# Altium schematic sheet 2_Sensor.schdoc
size 309 x 220 mm; Symbol: Sheet-Symbol_A4; Device: Sheet-Symbol_A4; @Project Name: 2026_ALTIS_V2.0; @Page Count: 3; @Update Date: 2026-04-05; @Create Date: 2026-04-05; @Schematic Name: 2026_ALTIS; @Page No: 2; @Page Name: Sensor; Company: EasyEDA.com; Version: V1.0; Page Size: A4; @Create Time: 05:22:19; @Update Time: 14:22:30; @Board Name: 2026_ALTIS
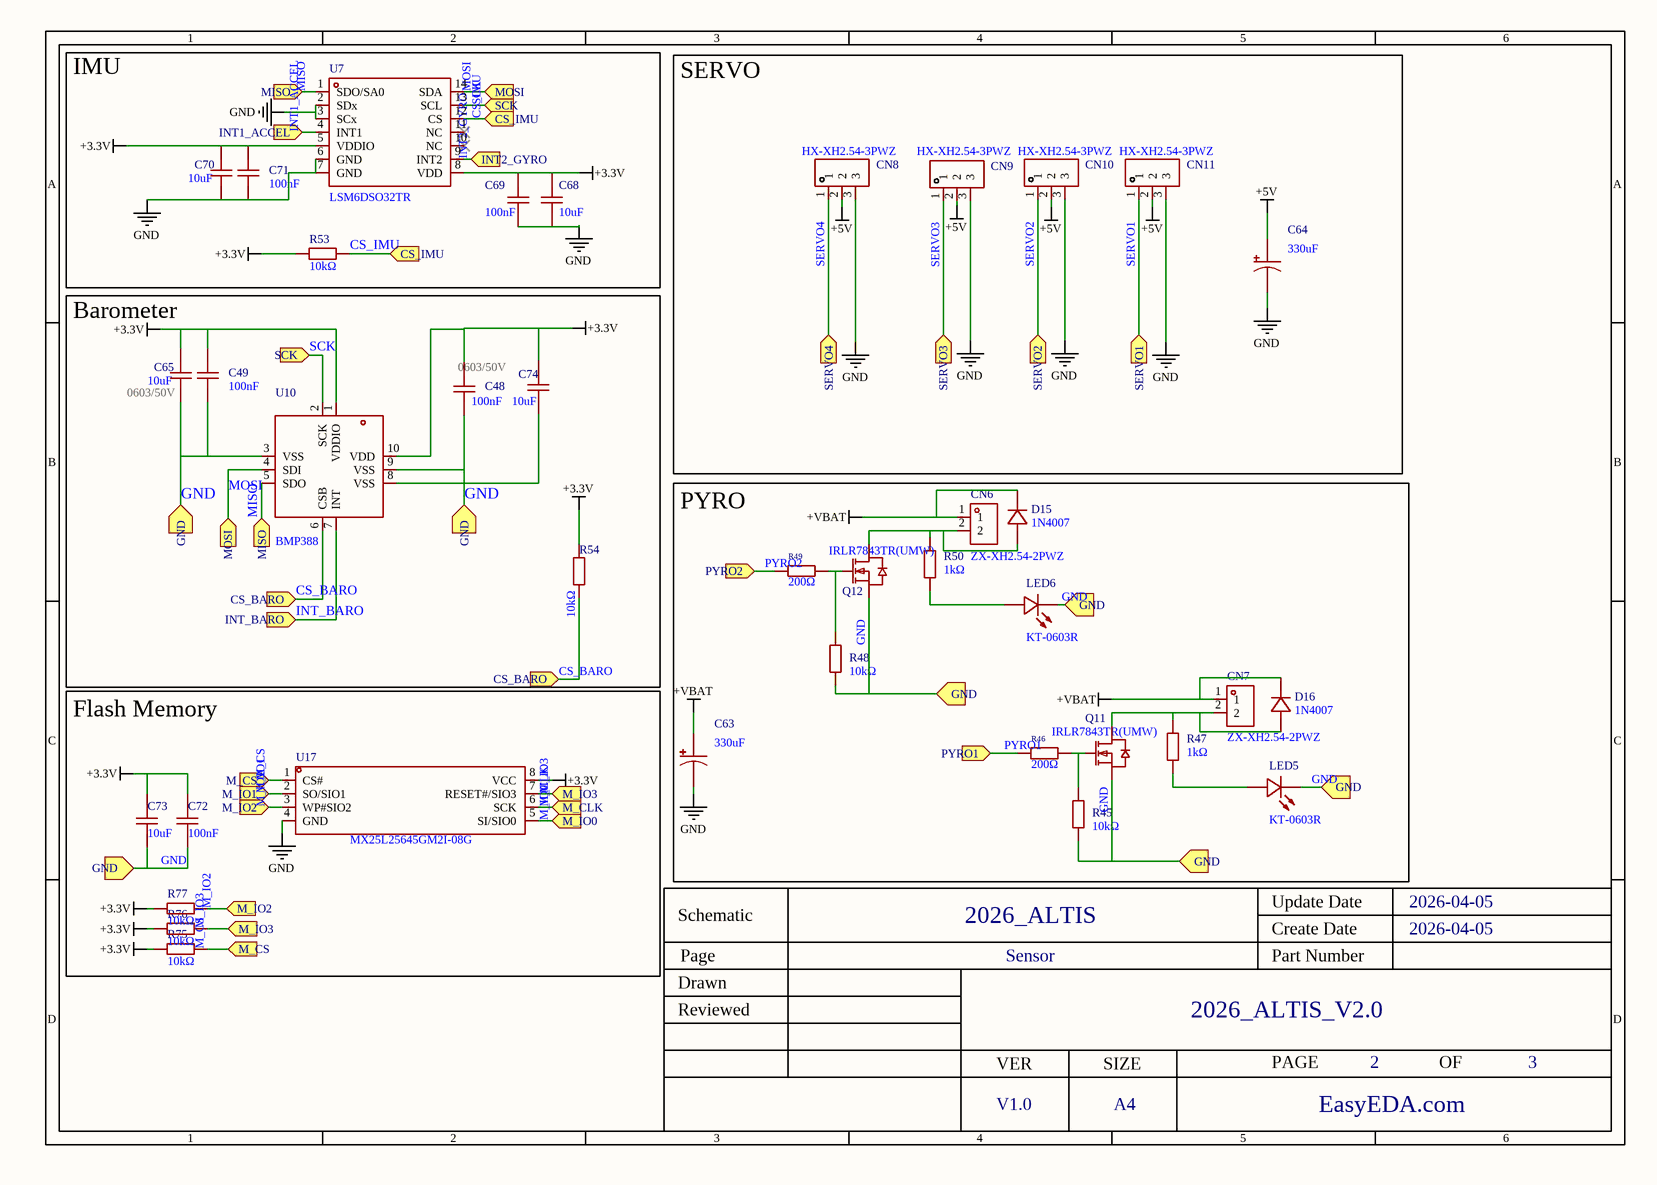
[diagram p0: 2_Sensor.schdoc]

## Parts
C48  100nF  [C0603]
C49  100nF  [C0603]
C63  330uF  [CAP-SMD_BD8.0-L8.3-W8.3-LS9.3-FD-1]
C64  330uF  [CAP-SMD_BD8.0-L8.3-W8.3-LS9.3-FD-1]
C65  10uF  [C0603]
C68  10uF  [C0603]
C69  100nF  [C0603]
C70  10uF  [C0603]
C71  100nF  [C0603]
C72  100nF  [C0603]
C73  10uF  [C0603]
C74  10uF  [C0603]
CN6  ZX-XH2.54-2PWZ  [CONN-TH_2P-P2.50_ZX-XH2.54-2PWZ]
CN7  ZX-XH2.54-2PWZ  [CONN-TH_2P-P2.50_ZX-XH2.54-2PWZ]
CN8  HX-XH2.54-3PWZ  [CONN-TH_3P-P2.50_BX-HA2.54-3PWZ]
CN9  HX-XH2.54-3PWZ  [CONN-TH_3P-P2.50_BX-HA2.54-3PWZ]
CN10  HX-XH2.54-3PWZ  [CONN-TH_3P-P2.50_BX-HA2.54-3PWZ]
CN11  HX-XH2.54-3PWZ  [CONN-TH_3P-P2.50_BX-HA2.54-3PWZ]
D15  1N4007  [SMA_L4.3-W2.5-LS5.0-RD]
D16  1N4007  [SMA_L4.3-W2.5-LS5.0-RD]
LED5  KT-0603R  [LED0603-RD]
LED6  KT-0603R  [LED0603-RD]
Q11  IRLR7843TR(UMW)  [TO-252-2_L6.5-W6.1-P4.58-LS10.0-BL]
Q12  IRLR7843TR(UMW)  [TO-252-2_L6.5-W6.1-P4.58-LS10.0-BL]
R45  10kΩ  [R0603]
R46  200Ω  [R0603]
R47  1kΩ  [R0603]
R48  10kΩ  [R0603]
R49  200Ω  [R0603]
R50  1kΩ  [R0603]
R53  10kΩ  [R0603]
R54  10kΩ  [R0603]
R75  10kΩ  [R0603]
R76  10kΩ  [R0603]
R77  10kΩ  [R0603]
U7  LSM6DSO32TR  [LGA-14_L3.0-W2.5-P0.50-TL]
U10  BMP388  [SENSORM-SMD_BMP388]
U17  MX25L25645GM2I-08G  [SOIC-8_L5.3-W5.3-P1.27-LS8.0-BL]

## Blocks framed on the sheet
IMU: C68-C71 R53 U7
SERVO: C64 CN8-CN11
Barometer: C48 C49 C65 C74 R54 U10
PYRO: C63 CN6 CN7 D15 D16 LED5 LED6 Q11 Q12 R45-R50
Flash Memory: C72 C73 R75-R77 U17

## Ports
CS_BARO (in), CS_IMU (in), GND (in), INT1_ACCEL (in), INT2_GYRO (in), INT_BARO (in), M_CLK (in), M_CS (in), M_IO0 (in), M_IO1 (in), M_IO2 (in), M_IO3 (in), MISO (in), MOSI (in), PYRO1 (in), PYRO2 (in), SCK (in), SERVO1 (in), SERVO2 (in), SERVO3 (in), SERVO4 (in)

## Nets
+3.3V: C48.2 C49.2 C65.2 C68.2 C69.2 C70.2 C71.2 C72.2 C73.2 C74.2 R53.2 R54.2 R75.2 R76.2 R77.2 U7.5(VDDIO) U7.8(VDD) U10.1(VDDIO) U10.10(VDD) U17.8(VCC)
+5V: C64.1 CN8.2 CN9.2 CN10.2 CN11.2
+VBAT: C63.1 CN6.1 CN7.1 D15.1(K) D16.1(K)
GND: C48.1 C49.1 C63.2 C64.2 C65.1 C68.1 C69.1 C70.1 C71.1 C72.1 C73.1 C74.1 CN8.3 CN9.3 CN10.3 CN11.3 LED5.1(K) LED6.1(K) Q11.3(S) Q12.3(S) R45.1 R48.1 U7.2(SDx) U7.3(SCx) U7.6(GND) U7.7(GND) U10.3(VSS) U10.8(VSS) U10.9(VSS) U17.4(GND) ; port GND
CS_BARO: R54.1 U10.6(CSB) ; port CS_BARO
CS_IMU: R53.1 U7.12(CS) ; port CS_IMU
INT1_ACCEL: U7.4(INT1) ; port INT1_ACCEL
INT2_GYRO: U7.9(INT2) ; port INT2_GYRO
INT_BARO: U10.7(INT) ; port INT_BARO
M_CLK: U17.6(SCK) ; port M_CLK
M_CS: R75.1 U17.1(CS#) ; port M_CS
M_IO0: U17.5(SI/SIO0) ; port M_IO0
M_IO1: U17.2(SO/SIO1) ; port M_IO1
M_IO2: R77.1 U17.3(WP#SIO2) ; port M_IO2
M_IO3: R76.1 U17.7(RESET#/SIO3) ; port M_IO3
MISO: U7.1(SDO/SA0) U10.5(SDO) ; port MISO
MOSI: U7.14(SDA) U10.4(SDI) ; port MOSI
PYRO1: R46.1 ; port PYRO1
PYRO2: R49.1 ; port PYRO2
SCK: U7.13(SCL) U10.2(SCK) ; port SCK
SERVO1: CN11.1 ; port SERVO1
SERVO2: CN10.1 ; port SERVO2
SERVO3: CN9.1 ; port SERVO3
SERVO4: CN8.1 ; port SERVO4
NetCN6_2: CN6.2 D15.2(A) Q12.2(D) R50.2
NetCN7_2: CN7.2 D16.2(A) Q11.2(D) R47.2
NetLED5_2: LED5.2(A) R47.1
NetLED6_2: LED6.2(A) R50.1
NetQ11_1: Q11.1(G) R45.2 R46.2
NetQ12_1: Q12.1(G) R48.2 R49.2

Not connected (* = marked no-connect by the designer): U7 10(NC)* 11(NC)*

## Notes on the sheet
- (near C65) 0603/50V
- (near C48) 0603/50V
- 1
- 2
- 3
- 4
- 5
- 6
- A
- B
- C
- Schematic
- 2026_ALTIS
- Create Date
- Update Date
- 2026-04-05
- Reviewed
- Drawn
- Page
- Sensor
- Part Number
- 2026_ALTIS_V2.0
- D
- VER
- SIZE
- PAGE
- OF
- V1.0
- A4
- EasyEDA.com

## Library data of the parts
C48 C49 C69 C71 C72 = CC0603KRX7R9BB104: Manufacturer: YAGEO(国巨); Add into BOM: yes; Tolerance: ±10%; Voltage Rating: 50V; Temperature Coefficient: X7R; Symbol: CC0603KRX7R9BB104; Device: CC0603KRX7R9BB104; LCSC Part Name: 100nF ±10% 50V; Supplier Part: C14663; Manufacturer Part: CC0603KRX7R9BB104; Supplier Footprint: 0603; Datasheet: https://item.szlcsc.com/datasheet/CC0603KRX7R9BB104/15331.html; Supplier: LCSC; Convert to PCB: yes; Value: 100nF
C63 C64 = RVT1E331M0810_C335985: Manufacturer: ROQANG(容强); Add into BOM: yes; Tolerance: ±20%; Voltage Rating: 25V; Ripple Current: 228mA@120Hz; Lifetime: 2000hrs@105℃; Symbol: RVT1E331M0810_C335985; Device: RVT1E331M0810_C335985; LCSC Part Name: 330uF ±20% 25V; Supplier Part: C335985; Manufacturer Part: RVT1E331M0810; Supplier Footprint: SMD,D8xL10.2mm; Supplier: LCSC; Convert to PCB: yes; Value: 330uF; Equivalent Series Resistance(ESR): -; Diameter: 8mm; Height - Seated (Max): 10.2mm; Operating Temperature: -40℃~+105℃
C65 C68 C70 C73 C74 = CL10A106KP8NNNC: Manufacturer: SAMSUNG(三星); Add into BOM: yes; Tolerance: ±10%; Voltage Rating: 10V; Temperature Coefficient: X5R; Symbol: CL10A106KP8NNNC; Device: CL10A106KP8NNNC; LCSC Part Name: 10uF ±10% 10V; Supplier Part: C19702; Manufacturer Part: CL10A106KP8NNNC; Supplier Footprint: 0603; Datasheet: https://item.szlcsc.com/datasheet/CL10A106KP8NNNC/20411.html; Supplier: LCSC; Convert to PCB: yes; Value: 10uF
CN6 CN7 = ZX-XH2.54-2PWZ: Manufacturer: Megastar(兆星); Add into BOM: no; Convert to PCB: yes; Pins Structure: 1x2P; Pitch: 2.5mm; Reference Series: XH; Number of PINs Per Row: 2; Current Rating: 2A; Voltage Rating: 250V; Plastic Material: PA66; Flame Retardant Rating: UL94V-0; Z-Height of the Board: 5.9mm; X-Length of Bottom Edge on Board (Spacing Line): 7.5mm; Y-Width of Bottom Edge on Board: 7.32mm; Symbol: ZX-XH2.54-2PWZ; Device: ZX-XH2.54-2PWZ; LCSC Part Name: 1x2P 间距:2.5mm 弯插 系列:XH; Supplier Part: C7429641; Manufacturer Part: ZX-XH2.54-2PWZ; Supplier Footprint: 弯插,P=2.5mm; JLCPCB Part Class: Extended Part; Datasheet: https://item.szlcsc.com/datasheet/ZX-XH2.54-2PWZ/8427558.html; Supplier: LCSC; Mounting Type: Right Angle; Number of Pins: 2P; Number of Rows: 1; Row Spacing: -; Contact Material: Brass; Contact Plating: Tin; Operating Temperature: -25℃~+85℃; Supplementary Features: -; Color: White
CN8-CN11 = HX-XH2.54-3PWZ: Manufacturer: hanxia(韩下); Add into BOM: no; Convert to PCB: yes; Pins Structure: 1x3P; Pitch: 2.5mm; Reference Series: XH; Number of PINs Per Row: 3; Current Rating: 3A; Voltage Rating: 250V; Plastic Material: PA66; Flame Retardant Rating: UL94V-0; Symbol: HX-XH2.54-3PWZ; Device: HX-XH2.54-3PWZ; LCSC Part Name: 1x3P 间距:2.5mm 弯插 系列:XH; Supplier Part: C48641715; Manufacturer Part: HX-XH2.54-3PWZ; Supplier Footprint: 弯插,P=2.5mm; JLCPCB Part Class: Extended Part; Datasheet: https://item.szlcsc.com/datasheet/HX-XH2.54-3PWZ/50919911.html; Supplier: LCSC; Mounting Type: Right Angle; Number of Pins: 3P; Number of Rows: 1; Row Spacing: -; Contact Material: Brass; Contact Plating: Tin; Operating Temperature: -25℃~+85℃; Color: White
D15 D16 = 1N4007_C727081: Manufacturer: TWGMC(迪嘉); Add into BOM: yes; Diode Configuration: Independent; Voltage - Forward(Vf@If): 1.1V@1A; Voltage - DC Reverse(Vr): 1kV; Current - Rectified: 1A; Reverse Leakage Current (Ir): 5uA; Symbol: 1N4007_C727081; Device: 1N4007_C727081; LCSC Part Name: 1N4007; Supplier Part: C727081; Manufacturer Part: 1N4007; Supplier Footprint: SMA(DO-214AC); JLCPCB Part Class: Extended Part; Datasheet: https://item.szlcsc.com/datasheet/1N4007/774186.html; Supplier: LCSC; Convert to PCB: yes
LED5 LED6 = KT-0603R: Manufacturer: KENTO; Add into BOM: yes; Emitted Color: Red; Symbol: KT-0603R; Device: KT-0603R; LCSC Part Name: 0603 红灯 高亮; Supplier Part: C2286; Manufacturer Part: KT-0603R; Supplier Footprint: 0603; JLCPCB Part Class: Basic Part; Datasheet: https://atta.szlcsc.com/upload/public/pdf/source/20160616/1466072038404.pdf; Supplier: LCSC; Convert to PCB: yes; Power Dissipation: -; Forward Current: -; Dominant Wavelength: -; Peak Wavelength: -; Diode Configuration: -; Lens Color: -; Color Temperature: -; Viewing Angle: -; Mounting Sytle: -; Operating Temperature: -40℃~+85℃
Q11 Q12 = IRLR7843TR(UMW): Manufacturer: UMW(友台半导体); Add into BOM: yes; Drain to Source Voltage: 30V; Current - Continuous Drain(Id): 161A; RDS(on): 2.6mΩ@10V; Pd - Power Dissipation: 140W; Gate Threshold Voltage (Vgs(th)): 2.5V@250uA; Gate Charge(Qg): 9.1nC@4.5V; Input Capacitance(Ciss): 4.38nF; Reverse Transfer Capacitance (Crss@Vds): 430pF; Type: N-Channel; Output Capacitance(Coss): 940pF; Symbol: IRLR7843TR(UMW); Device: IRLR7843TR(UMW); LCSC Part Name: N沟道 耐压:30V 电流:161A; Supplier Part: C7499399; Manufacturer Part: IRLR7843TR(UMW); Supplier Footprint: TO-252; JLCPCB Part Class: Extended Part; Datasheet: https://item.szlcsc.com/datasheet/IRLR7843TR(UMW)/8574094.html; Supplier: LCSC; Convert to PCB: yes; Operating Temperature: -55℃~+175℃
R45 R48 R53 R54 R75-R77 = 0603WAF1002T5E: Manufacturer: UNI-ROYAL(厚声); Add into BOM: yes; Tolerance: ±1%; Power(Watts): 100mW; Voltage-Supply(Max): 75V; Temperature Coefficient: ±100ppm/℃; Symbol: 0603WAF1002T5E; Device: 0603WAF1002T5E; LCSC Part Name: 厚膜电阻 10kΩ ±1% 100mW; Supplier Part: C25804; Manufacturer Part: 0603WAF1002T5E; Supplier Footprint: 0603; JLCPCB Part Class: Basic Part; Datasheet: https://item.szlcsc.com/datasheet/0603WAF1002T5E/26547.html; Supplier: LCSC; Convert to PCB: yes; Type: Thick Film Resistor; Value: 10kΩ; Operating Temperature: -55℃~+155℃
R46 R49 = 0603WAF2000T5E: Manufacturer: UNI-ROYAL(厚声); Add into BOM: yes; Tolerance: ±1%; Power(Watts): 100mW; Voltage-Supply(Max): 75V; Temperature Coefficient: ±100ppm/℃; Symbol: 0603WAF2000T5E; Device: 0603WAF2000T5E; Supplier: LCSC; Manufacturer Part: 0603WAF2000T5E; Supplier Part: C8218; Value: 200Ω; LCSC Part Name: 200Ω ±1% 100mW 厚膜电阻; Supplier Footprint: 0603; Datasheet: https://item.szlcsc.com/datasheet/0603WAF2000T5E/8708.html; Convert to PCB: yes; Type: Thick Film Resistor; Operating Temperature: -55℃~+155℃
R47 R50 = 0603WAF1001T5E: Manufacturer: UNI-ROYAL(厚声); Add into BOM: yes; Tolerance: ±1%; Power(Watts): 100mW; Voltage-Supply(Max): 75V; Temperature Coefficient: ±100ppm/℃; Symbol: 0603WAF1001T5E; Device: 0603WAF1001T5E; LCSC Part Name: 1kΩ ±1% 100mW 厚膜电阻; Supplier Part: C21190; Manufacturer Part: 0603WAF1001T5E; Supplier Footprint: 0603; JLCPCB Part Class: Basic Part; Datasheet: https://item.szlcsc.com/datasheet/0603WAF1001T5E/21904.html; Supplier: LCSC; Convert to PCB: yes; Type: Thick Film Resistor; Value: 1kΩ; Operating Temperature: -55℃~+155℃
U7 = LSM6DSO32TR: Manufacturer: ST(意法半导体); Add into BOM: yes; Sensor Type: 加速度计陀螺仪; Symbol: LSM6DSO32TR; Device: LSM6DSO32TR; LCSC Part Name: LSM6DSO32TR; Supplier Part: C1864162; Manufacturer Part: LSM6DSO32TR; Supplier Footprint: LGA-14(2.5x3); JLCPCB Part Class: Extended Part; Datasheet: https://atta.szlcsc.com/upload/public/pdf/source/20210701/34CD2F0BBC0E28C2A99EB6D9CC8DCB24.pdf; Supplier: LCSC; Convert to PCB: yes; Operating Temperature: -40℃~+85℃
U10 = BMP388: Manufacturer: Bosch(博世); Add into BOM: yes; Pressure range: 30Kpa~125Kpa; Voltage - Supply: 1.65V~3.6V; Symbol: BMP388; Device: BMP388; LCSC Part Name: BMP388; Supplier Part: C779278; Manufacturer Part: BMP388; Supplier Footprint: LGA-10(2x2); JLCPCB Part Class: Extended Part; Datasheet: https://item.szlcsc.com/datasheet/BMP388/828796.html; Supplier: LCSC; Convert to PCB: yes; Operating Temperature: -
U17 = MX25L25645GM2I-08G: Manufacturer: MXIC(旺宏电子); Add into BOM: yes; Interface: SPI; Memory Size: 256Mbit; Clock Frequency: 133MHz; Voltage - Supply: 2.7V~3.6V; Program / Erase Cycles: 100,000 Cycles; Page Programming Time (Tpp): 750us; Data Retention - TDR (Year): 20 Years; Symbol: MX25L25645GM2I-08G; Device: MX25L25645GM2I-08G; LCSC Part Name: MX25L25645GM2I-08G; Supplier Part: C190799; Manufacturer Part: MX25L25645GM2I-08G; Supplier Footprint: SOP-8-208mil; JLCPCB Part Class: Extended Part; Datasheet: https://item.szlcsc.com/datasheet/MX25L25645GM2I-08G/213043.html; Supplier: LCSC; Convert to PCB: yes; Operating Temperature: -40℃~+85℃